# EAGLE schematic freq_count_schematic_updated_11_6_2018 (EAGLE 9.2.0)
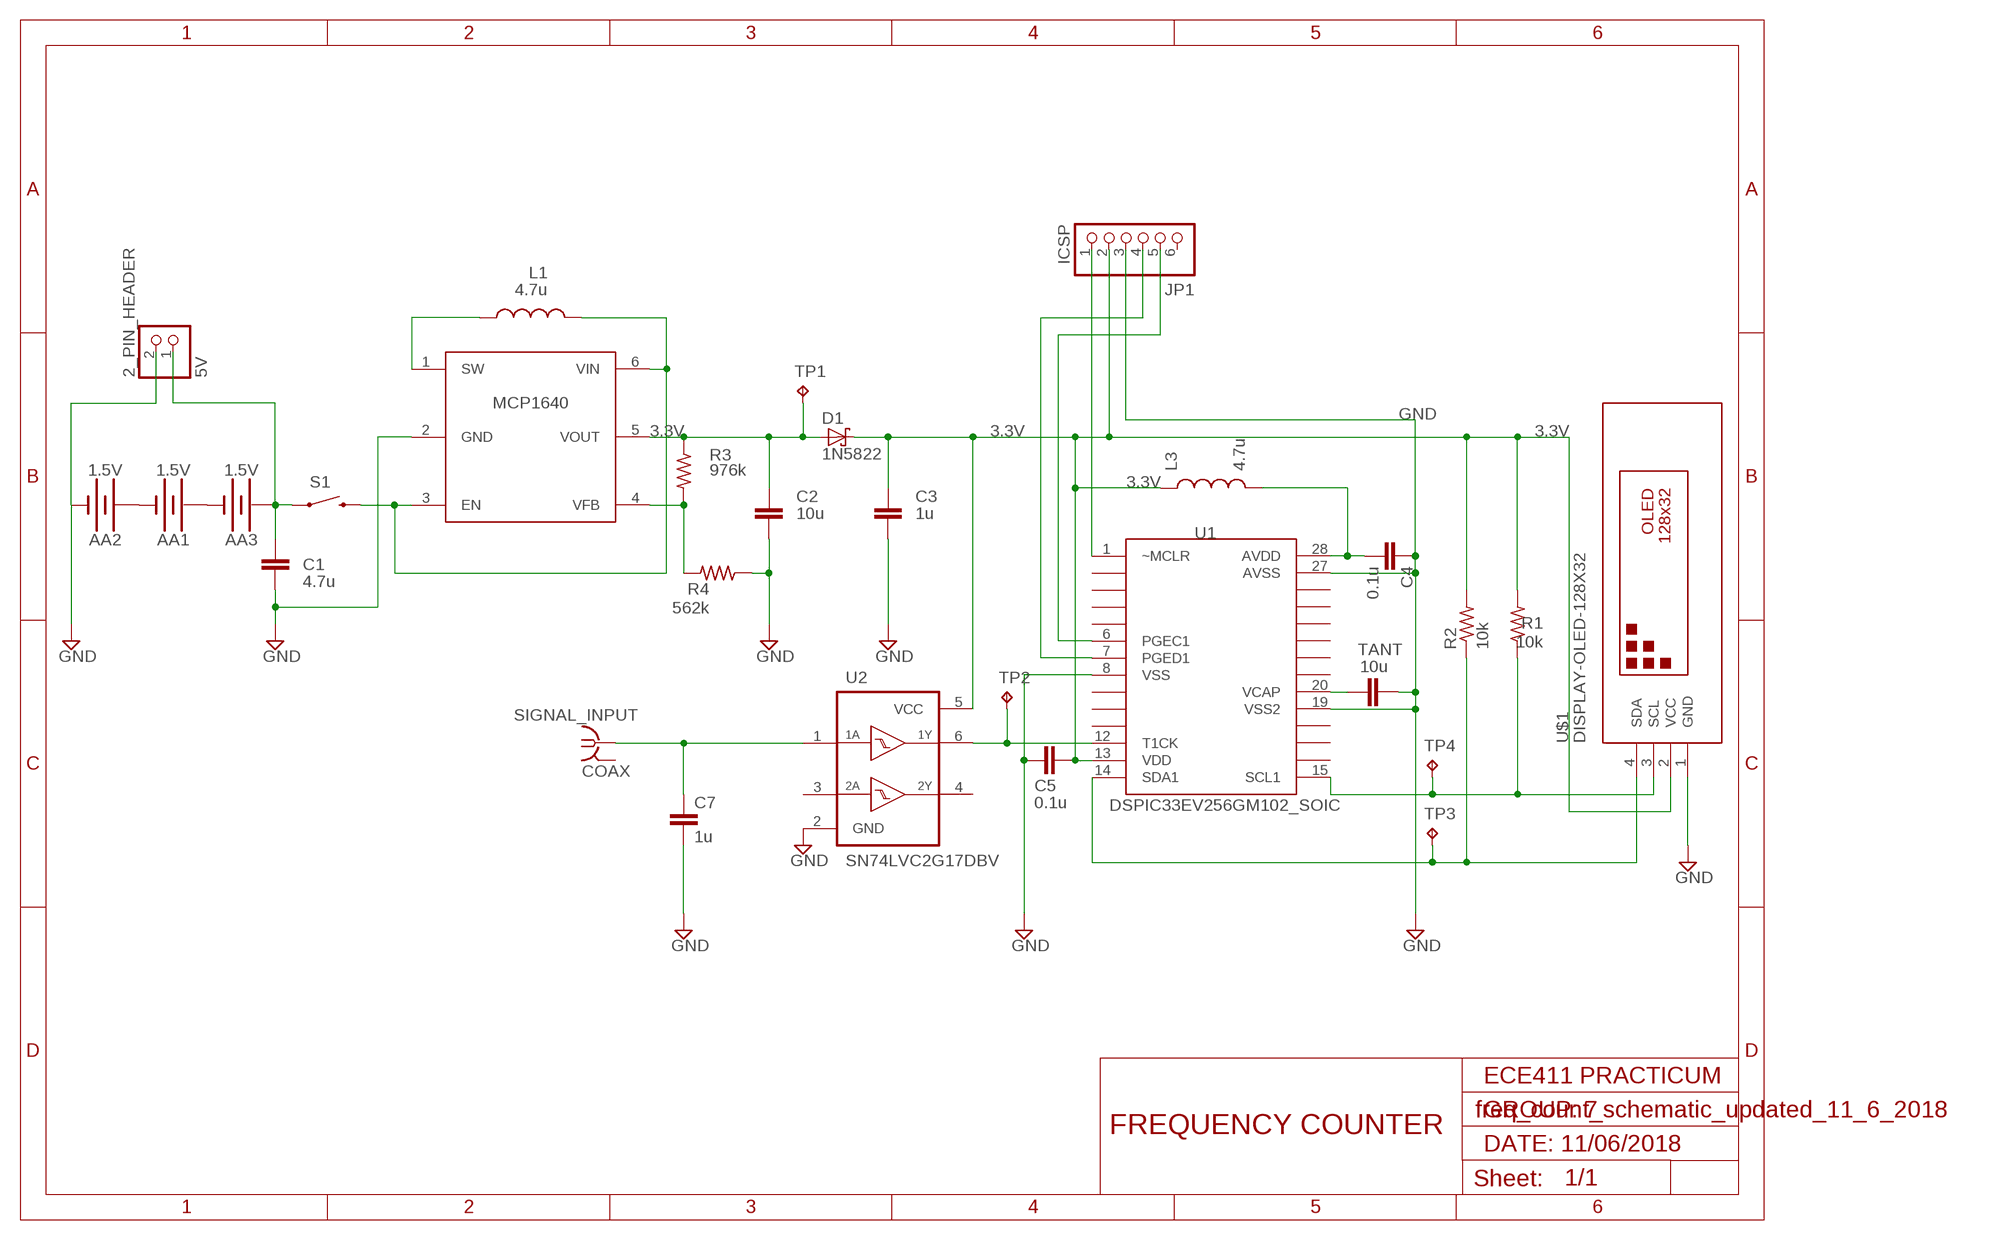
[diagram p0: schematic, sheet 1]

## Parts
2_PIN_HEADER  5V  JST_2PIN-THM-RA  [JST-PH-2-THM-RA]
AA1  1.5V  BATTERY-AA  [BATTERY-AA]
AA2  1.5V  BATTERY-AA  [BATTERY-AA]
AA3  1.5V  BATTERY-AA  [BATTERY-AA]
C1  4.7u  C2,5-3  [C2.5-3]
C2  10u  C2,5-3  [C2.5-3]
C3  1u  C2,5-3  [C2.5-3]
C4  0.1u  C2,5-3  [C2.5-3]
C5  0.1u  C2,5-3  [C2.5-3]
C7  1u  C2,5-3  [C2.5-3]
D1  1N5822  SCHOTTKY-DIODEAG  [AG]
JP1  ICSP  PINHD-1X6  [1X06]
L1  4.7u  INDUCTOR  [L0603]
L3  4.7u  INDUCTOR  [L0603]
MCP1  MCP1640  [SOP95P270X145-6]
R1  10k  R-US_M2012  [M2012]
R2  10k  R-US_M2012  [M2012]
R3  976k  R-US_M2012  [M2012]
R4  562k  R-US_M2012  [M2012]
S1  RS032G05A3SM-SPST-MOMENTARY-SWSMD-1101NE  [TACTILE-SWITCH-1101NE]
SIGNAL_INPUT  COAX  [MMCX-J-P-X-ST-EM1-MKT]
TANT  10u  C2,5-3  [C2.5-3]
TP1  TPB1,27  [B1,27]
TP2  TPB1,27  [B1,27]
TP3  TPB1,27  [B1,27]
TP4  TPB1,27  [B1,27]
U1  DSPIC33EV256GM102_SOIC  [SOIC127P1020X265-28]
U2  SN74LVC2G17DBV  [SOT23-6]
U$1  DISPLAY-OLED-128X32  [DISPLAY-OLED-128X32]

## Nets
3.3V: C3.1 C5.1 D1.C JP1.2 L3.1 R1.2 R2.2 U1.13(VDD) U2.5(VCC) U$1.2(VCC)
GND: 2_PIN_HEADER.2 AA2.GND@1(-) C1.2 C2.2 C3.2 C4.1 C5.2 C7.2 JP1.3 MCP1.2(GND) R4.1 TANT.2 U1.8(VSS) U1.19(VSS2) U1.27(AVSS) U2.2(GND) U$1.1(GND)
N$1: TANT.1 U1.20(VCAP)
N$2: 2_PIN_HEADER.1 AA3.PWR@1(+) C1.1 S1.1
N$3: L1.2 MCP1.3(EN) MCP1.6(VIN) S1.2
N$4: AA1.PWR@1(+) AA3.GND@1(-)
N$5: R1.1 TP4.TP U1.15(SCL1) U$1.3(SCL)
N$6: C7.1 SIGNAL_INPUT.1 U2.1(1A)
N$7: TP2.TP U1.12(T1CK) U2.6(1Y)
N$8: C2.1 D1.A MCP1.5(VOUT) R3.1 TP1.TP
N$10: C4.2 L3.2 U1.28(AVDD)
N$11: L1.1 MCP1.1(SW)
N$12: MCP1.4(VFB) R3.2 R4.2
N$13: AA1.GND@1(-) AA2.PWR@1(+)
N$14: JP1.1 U1.1(~MCLR)
N$16: JP1.4 U1.7(PGED1)
N$17: JP1.5 U1.6(PGEC1)
N$18: R2.1 TP3.TP U1.14(SDA1) U$1.4(SDA)
Unconnected: JP1.6 U1.2 U1.3 U1.4 U1.5 U1.9 U1.10 U1.11 U1.16 U1.17 U1.18 U1.21 U1.22 U1.23 U1.24 U1.25 U1.26 U2.3(2A) U2.4(2Y)

## Notes on the sheet
- 3.3V
- ECE411 PRACTICUM
- GROUP: 7
- FREQUENCY COUNTER
- DATE: 11/06/2018

## Power pins joined to a net without a drawn wire
GND: SIGNAL_INPUT.2@1(GND) SIGNAL_INPUT.2@2(GND) SIGNAL_INPUT.2@3(GND) SIGNAL_INPUT.2@4(GND)

## Library data of the parts
2_PIN_HEADER = adafruit:JST_2PIN: JST 2-Pin Connectors of various flavors SMT-RA (S2B-PH-SM4) 4UConnector #17311 SMT (B2B-PH-SM4) THM-RA (S2B-PH) THM (B2B-PH); COST: 0.11; MFG: Harwin Inc.; MPN: M20-9990246; VENDOR: Digikey
AA1-AA3 = SparkFun-Batteries:BATTERY: Battery - Single Cell A variety of battery chemistries, sizes, and footprints. Device List: 20MM_PTH - Coin Cell Battery Holder - 20mm (PTH) <https://www.sparkfun.com/products/783> 6.8MM_PTH - Coin Cell Battery Holder - 6.8MM(SMD) <https://www.digikey.com/product-detail/en/seiko-instruments/MS621FE-FL11E/728-1057-ND/1889208?WT.srch=1&gclid=CNOQ5a6LzdQCFZS2wAodXCkE0g> 12MM_SMD - Coin Cell Battery Holder - 12mm (SMD) <https://www.sparkfun.com/products/10592> 12MM_PTH - Coin Cell Battery Holder - 12mm (PTH) <https://www.sparkfun.com/products/7948> 20MM_SMD - 20mm Coin Cell Battery Holder (SMD) (2 legs) Used on the Big Time Watch Kit <https://www.sparkfun.com/products/11734> 20MM_SMD_4LEGS - Coin Cell Battery Holder - 20mm (SMD) <https://www.sparkfun.com/products/11892> 20MM_SMD_4LEGS_OVERPASTE - Coin Cell Battery Holder - 20mm (SMD) <https://www.sparkfun.com/products/11892> (Over-paste on the legs) 24.5MM_PTH - Coin Cell Battery Holder - 24.5mm (PTH) <https://www.sparkfun.com/products/8863> 9V - 9V Battery Holder - PC Mount Used on the SparkFun SparkPunk Sound Kit <https://www.sparkfun.com/products/11177> and SparkFun SparkPunk Sequencer Kit <https://www.sparkfun.com/products/12707> 18650 - Battery Holder - 18650 (PTH) <https://www.sparkfun.com/products/13113> AA - Battery Holder - 1xAA (PTH) <https://www.sparkfun.com/products/7949> AAA - Battery Holder - 1xAAA (PTH) <https://www.sparkfun.com/products/12718> AA_KIT - Battery Holder - 1xAA (PTH) <https://www.sparkfun.com/products/7949> Special kit package - pads only have exposed copper on one side of the board. AAA_KIT - Battery Holder - 1xAAA (PTH) <https://www.sparkfun.com/products/12718> Special kit package - pads only have exposed copper on one side of the board.; COST: 0.4; MFG: Energizer; MPN: E91DP2; PROD_ID: BATT-08316; SF_SKU: PRT-07949; VENDOR: Amazon
C1 = capacitor-wima:C: CAPACITOR naming: grid - package width; COST: 0.23; MFG: Panasonic Electronic Components; MPN: ECE-A1VKS4R7I; VENDOR: Digikey
C2 = capacitor-wima:C: CAPACITOR naming: grid - package width; COST: 0.23; MFG: Panasonic Electronic Components; MPN: ECA-1HM100; VENDOR: Digikey
C3 C7 = capacitor-wima:C: CAPACITOR naming: grid - package width; COST: 0.23; MFG: Panasonic Electronic Components; MPN: ECA-2CHG010; VENDOR: Digikey
C4 C5 = capacitor-wima:C: CAPACITOR naming: grid - package width; COST: 0.1; MFG: KEMET; MPN: C0805C104Z3VACTU; VENDOR: Mouser
D1 = adafruit:SCHOTTKY-DIODE: Schottky Diode; COST: 0.43; MFG: ON semiconductor; MPN: 1N5822G; VENDOR: Digikey
JP1 = adafruit:PINHD-1X6: PIN HEADER; COST: 0
L1 L3 = BeagleBone_Blue_R3:INDUCTOR: Inductors Basic Inductor/Choke - 0603 and 1206. Footprints are not proven and vary greatly between part numbers. SRN6045- 33uH, 20% 1.4A; COST: 0.11; MFG: Bourns; MPN: CV201210-4R7K; VENDOR: Mouser
MCP1 = WBlib:MCP1640: MCP1640; COST: 0.59; MFG: Microchip Technology; MPN: MCP1640DT-I/CHY; VENDOR: Digikey
R1 R2 = adafruit:R-US_: RESISTOR, American symbol; COST: 0.1; MFG: Bourns; MPN: CR1206-JW-114ELF; VENDOR: Mouser
R3 = adafruit:R-US_: RESISTOR, American symbol; COST: 0.1; MFG: Bourns; MPN: CR0805-FX-9763elf; VENDOR: Mouser
R4 = adafruit:R-US_: RESISTOR, American symbol; COST: 0.1; MFG: Bourms; MPN: CR0805-FX-5623ELF; VENDOR: Mouser
S1 = BeagleBone_Blue_R3:RS032G05A3SM-SPST-MOMENTARY-SW: 6x3.5mm 2-pin Momentary Switch (Push-button) Digikey Link <https://www.digikey.com/products/en?keywords=CKN10388TR-ND> Datasheet <https://media.digikey.com/pdf/Data%20Sheets/C&K/RS-032G05_-SM_RT.pdf>; COST: 0.45; MFG: C&K; MPN: OS102011MS2QN1; PROD_ID: SWCH-00815; VENDOR: DIGIKEY
SIGNAL_INPUT = con-samtec:COAX: MMCX STRAIGHT, EDGE MOUNT JACK- 50 OHM Source: http://www.samtec.com/ftppub/cpdf/MMCX-J-P-X-ST-EM1-MKT.pdf; COST: 7.9; MF: Samtec Inc.; MFG: Cal Test Electronics; MPN: BKCT2942-100-ND; OC_FARNELL: unknown; OC_NEWARK: unknown; VENDOR: Digikey
TANT = capacitor-wima:C: CAPACITOR naming: grid - package width; COST: .47; MFG: KEMET; MPN: A758BG106M1EAAE070; VENDOR: Mouser
TP1-TP4 = testpad:TP: Test pad; COST: 0
U1 = WBlib:DSPIC33EV256GM102: Microchip dsPIC33EV256GM102; COST: 3.67; MFG: Microchip Technology; MPN: DSPIC33EV256GM102; VENDOR: Digikey
U2 = SN74LVC2G17:SN74LVC2G17: DUAL SCHMITT-TRIGGER BUFFER; AVAILABILITY: Unavailable; COST: 0.42; DESCRIPTION: Dual Schmitt-Trigger Buffer; MF: Texas Instruments; MFG: ON semiconductor; MP: SN74LVC2G17; MPN: NC7WZ14P6X; PACKAGE: XFDFN-6 Texas Instruments; PRICE: None; VENDOR: Digikey
U$1 = diy-modules:DISPLAY-OLED-128X32: 128x32 Dot Matrix OLED Module with I2C interface based on SSD1306 chip More details available here: http://www.tinyosshop.com/index.php?route=product/product&product_id=953 Schematic available here: http://www.tinyosshop.com/datasheet/OLED%2012832.pdf SSD1306 datasheet: https://cdn-shop.adafruit.com/datasheets/SSD1306.pdf Click here to find device on ebay.com <http://www.ebay.com/sch/oled+display+128x32+i2c>; COST: 5.50; MFG: Generic; MPN: SSD1306; VENDOR: Amazon